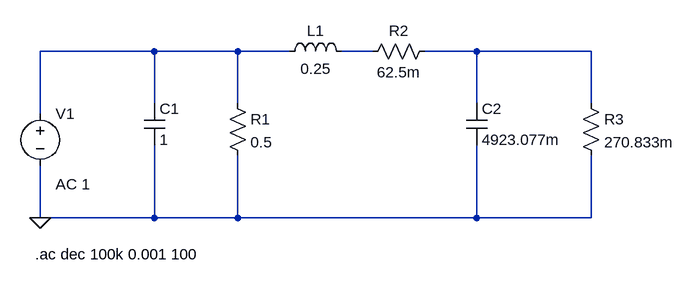
[diagram p0: schematic 2.asc]
2.asc, the LTspice schematic file:
Version 4
SHEET 1 1180 740
WIRE 368 32 192 32
WIRE 496 32 368 32
WIRE 576 32 496 32
WIRE 704 32 656 32
WIRE 864 32 784 32
WIRE 1040 32 864 32
WIRE 368 112 368 32
WIRE 496 112 496 32
WIRE 864 112 864 32
WIRE 1040 112 1040 32
WIRE 192 128 192 32
WIRE 192 288 192 208
WIRE 368 288 368 176
WIRE 368 288 192 288
WIRE 496 288 496 192
WIRE 496 288 368 288
WIRE 864 288 864 176
WIRE 864 288 496 288
WIRE 1040 288 1040 192
WIRE 1040 288 864 288
FLAG 192 288 0
SYMBOL voltage 192 112 R0
WINDOW 123 24 124 Left 2
WINDOW 39 0 0 Left 0
SYMATTR Value2 AC 1
SYMATTR InstName V1
SYMATTR Value ""
SYMBOL cap 352 112 R0
SYMATTR InstName C1
SYMATTR Value 1
SYMBOL res 480 96 R0
SYMATTR InstName R1
SYMATTR Value 0.5
SYMBOL ind 560 48 R270
WINDOW 0 32 56 VTop 2
WINDOW 3 5 56 VBottom 2
SYMATTR InstName L1
SYMATTR Value 0.25
SYMBOL res 800 16 R90
WINDOW 0 0 56 VBottom 2
WINDOW 3 32 56 VTop 2
SYMATTR InstName R2
SYMATTR Value 62.5m
SYMBOL cap 848 112 R0
SYMATTR InstName C2
SYMATTR Value 4923.077m
SYMBOL res 1024 96 R0
SYMATTR InstName R3
SYMATTR Value 270.833m
TEXT 184 344 Left 2 !.ac dec 100k 0.001 100

The netlist it stands for:
* 2.asc
V1 N001 0 AC 1
C1 N001 0 1
R1 N001 0 0.5
L1 N001 N002 0.25
R2 N003 N002 62.5m
C2 N003 0 4923.077m
R3 N003 0 270.833m
.ac dec 100k 0.001 100
.backanno
.end